# EAGLE design Dub_Siren (EAGLE 5.10)
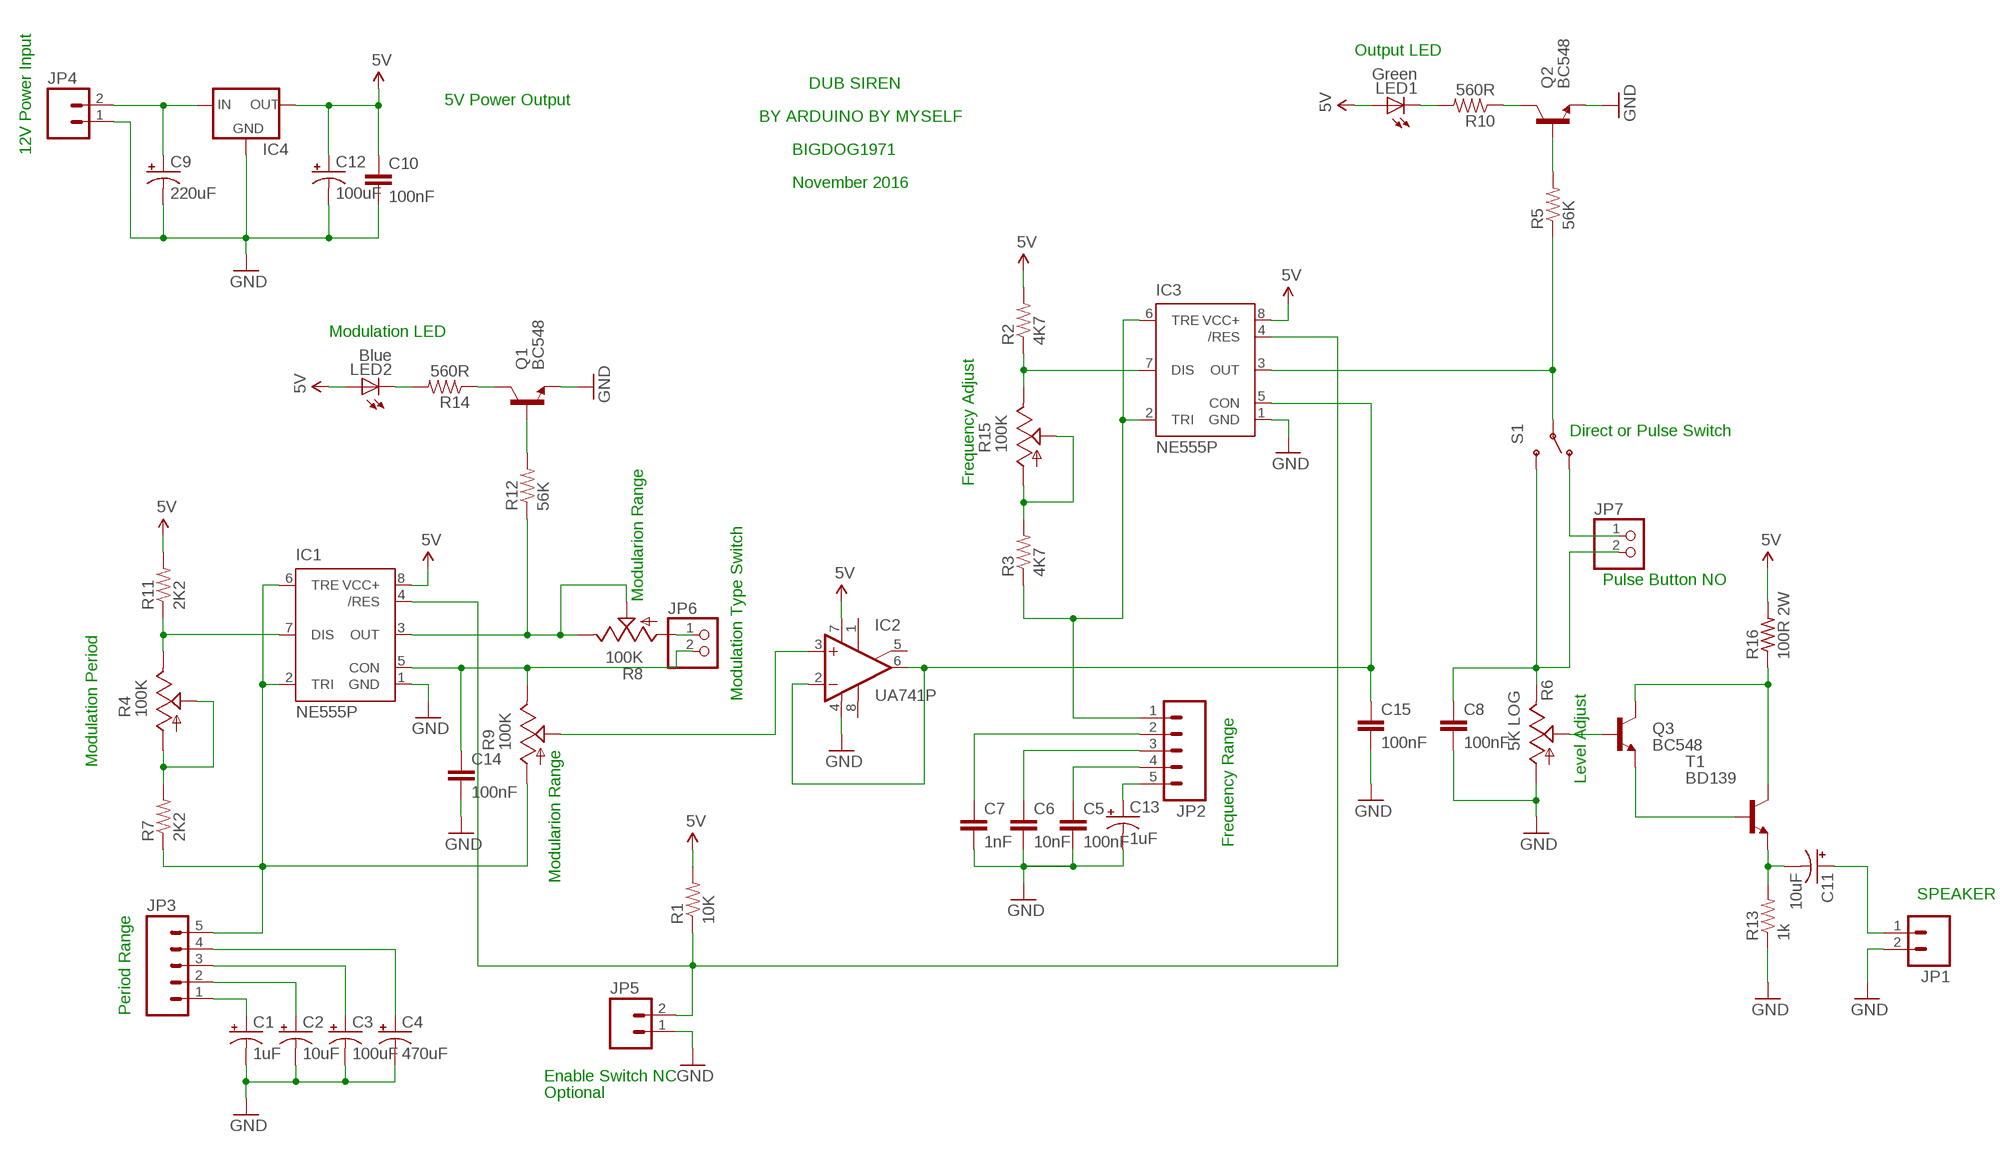
[diagram p0: schematic, sheet 1]

## Parts
C1  1uF  CAP_POLPTH1  [CPOL-RADIAL-100UF-25V]
C2  10uF  CAP_POLPTH1  [CPOL-RADIAL-100UF-25V]
C3  100uF  CAP_POLPTH1  [CPOL-RADIAL-100UF-25V]
C4  470uF  CAP_POLPTH1  [CPOL-RADIAL-100UF-25V]
C5  100nF  CAPPTH1  [CAP-PTH-5MM]
C6  10nF  CAPPTH1  [CAP-PTH-5MM]
C7  1nF  CAPPTH1  [CAP-PTH-5MM]
C8  100nF  CAPPTH1  [CAP-PTH-5MM]
C9  220uF  CAP_POLPTH1  [CPOL-RADIAL-100UF-25V]
C10  100nF  CAPPTH1  [CAP-PTH-5MM]
C11  10uF  CAP_POLPTH1  [CPOL-RADIAL-100UF-25V]
C12  100uF  CAP_POLPTH1  [CPOL-RADIAL-100UF-25V]
C13  1uF  CAP_POLPTH1  [CPOL-RADIAL-100UF-25V]
C14  100nF  CAPPTH1  [CAP-PTH-5MM]
C15  100nF  CAPPTH1  [CAP-PTH-5MM]
IC1  NE555P  [DIL-08]
IC2  UA741P  [DIL08]
IC3  NE555P  [DIL-08]
IC4  V_REG_78XXSINK  [TO220-IGO]
JP1  M02PTH3  [1X02_LONGPADS]
JP2  M05PTH_LONGPADS  [1X05_LONGPADS]
JP3  M05PTH_LONGPADS  [1X05_LONGPADS]
JP4  M02LOCK_LONGPADS  [1X02_LOCK_LONGPADS]
JP5  M02LOCK_LONGPADS  [1X02_LOCK_LONGPADS]
JP6  PINHD-1X2  [1X02]
JP7  PINHD-1X2  [1X02]
LED1  Green  LED5MM  [LED5MM]
LED2  Blue  LED5MM  [LED5MM]
Q1  BC548  TRANSISTOR_NPNTO-92-AMMO  [TO-92-AMMO]
Q2  BC548  TRANSISTOR_NPNTO-92-AMMO  [TO-92-AMMO]
Q3  BC548  TRANSISTOR_NPNTO-92-AMMO  [TO-92-AMMO]
R1  10K  RESISTORPTH-1/4W  [AXIAL-0.4]
R2  4K7  RESISTORPTH-1/4W  [AXIAL-0.4]
R3  4K7  RESISTORPTH-1/4W  [AXIAL-0.4]
R4  100K  TRIM_US-RS3  [RS3]
R5  56K  RESISTORPTH-1/4W  [AXIAL-0.4]
R6  5K LOG  TRIM_US-RS3  [RS3]
R7  2K2  RESISTORPTH-1/4W  [AXIAL-0.4]
R8  100K  TRIM_US-RS3  [RS3]
R9  100K  TRIM_US-RS3  [RS3]
R10  560R  RESISTORPTH-1/4W  [AXIAL-0.4]
R11  2K2  RESISTORPTH-1/4W  [AXIAL-0.4]
R12  56K  RESISTORPTH-1/4W  [AXIAL-0.4]
R13  1k  RESISTORPTH-1/4W  [AXIAL-0.4]
R14  560R  RESISTORPTH-1/4W  [AXIAL-0.4]
R15  100K  TRIM_US-RS3  [RS3]
R16  100R 2W  R-US_0309/12  [0309/12]
S1  SWITCH-SPSTKIT  [SWITCH-SPDT_KIT]
T1  BD139  [TO126]

## Nets
5V: C10.1 C12.1(+) IC1.8(VCC+) IC2.7(V+) IC3.8(VCC+) IC4.OUT LED1.A LED2.A R1.P$2 R2.P$2 R11.P$2 R16.2
GND: C1.2(-) C2.2(-) C3.2(-) C4.2(-) C5.2 C6.2 C7.2 C8.2 C9.2(-) C10.2 C12.2(-) C13.2(-) C14.2 C15.2 IC1.1(GND) IC2.4(V-) IC3.1(GND) IC4.GND JP1.2 JP4.1 JP5.1 Q1.1(E) Q2.1(E) R6.A R13.P$1
N$1: IC1.2(TRI) IC1.6(TRE) JP3.5 R7.P$1 R9.A
N$2: Q3.2(B) R6.S
N$3: R4.A R4.S R7.P$2
N$4: IC1.7(DIS) R4.E R11.P$1
N$5: C14.1 IC1.5(CON) JP6.2 R9.E
N$6: IC1.4(/RES) IC3.4(/RES) JP5.2 R1.P$1
N$7: IC1.3(OUT) R8.E R8.S R12.P$1
N$8: Q3.1(E) T1.3(B)
N$9: JP6.1 R8.A
N$10: C15.1 IC2.2(-IN) IC2.6(OUT) IC3.5(CON)
N$11: LED2.K(C) R14.P$2
N$12: Q1.3(C) R14.P$1
N$13: C13.1(+) JP2.5
N$14: IC3.7(DIS) R2.P$1 R15.E
N$15: R3.P$2 R15.A R15.S
N$16: C11.2(-) R13.P$2 T1.1(E)
N$17: IC3.2(TRI) IC3.6(TRE) JP2.1 R3.P$1
N$18: Q3.3(C) R16.1 T1.2(C)
N$19: LED1.K(C) R10.P$2
N$20: Q2.3(C) R10.P$1
N$21: Q2.2(B) R5.P$2
N$22: IC2.3(+IN) R9.S
N$23: IC3.3(OUT) R5.P$1 S1.2(P)
N$25: C4.1(+) JP3.4
N$26: C11.1(+) JP1.1
N$27: C3.1(+) JP3.3
N$28: C2.1(+) JP3.2
N$29: C1.1(+) JP3.1
N$30: C5.1 JP2.4
N$31: C6.1 JP2.3
N$32: C7.1 JP2.2
N$33: Q1.2(B) R12.P$2
N$34: C9.1(+) IC4.IN JP4.2
N$35: JP7.1 S1.1(O)
N$36: C8.1 JP7.2 R6.E S1.3(S)
Unconnected: IC2.1(ON1) IC2.5(ON2) IC2.8(OPT)

## Notes on the sheet
- Output LED
- DUB SIREN
- 5V Power Output
- BY ARDUINO BY MYSELF
- 12V Power Input | BIGDOG1971
- November 2016
- Modulation LED
- Direct or Pulse Switch
- Frequency Adjust
- Pulse Button NO
- Modularion Range
- Modulation Type Switch
- Frequency Range
- Modulation Period
- Level Adjust
- Modularion Range
- SPEAKER
- Period Range
- Enable Switch NC
- Optional

## Library data of the parts
C1-C4 C9 C11-C13 = SparkFun:CAP_POL: Capacitor Polarized These are standard SMD and PTH capacitors. Normally 10uF, 47uF, and 100uF in electrolytic and tantalum varieties. Always verify the external diameter of the through hole cap, it varies with capacity, voltage, and manufacturer. The EIA devices should be standard.
C5-C8 C10 C14 C15 = SparkFun:CAP: Capacitor Standard 0603 ceramic capacitor, and 0.1" leaded capacitor.
IC1 IC3 = SparkFun:NE555: General purpose bipolar Timer; MF: Arrow Electronics; MPN: NE555N; OC_FARNELL: 1467742; OC_NEWARK: 89K1486
IC2 = linear:*741: OP AMP
IC4 = SparkFun:V_REG_78XX: Voltage Regulator Standard 7805 5V regulator. IGO (Input Ground Output). Spark Fun Electronics SKU : COM-00107
JP1 JP4 JP5 = SparkFun:M02: Header 2 Standard 2-pin 0.1" header. Use with straight break away headers (SKU : PRT-00116), right angle break away headers (PRT-00553), swiss pins (PRT-00743), machine pins (PRT-00117), and female headers (PRT-00115). Molex polarized connector foot print use with SKU : PRT-08233 with associated crimp pins and housings.
JP2 JP3 = SparkFun:M05: Header 5 Standard 5-pin 0.1" header. Use with straight break away headers (SKU : PRT-00116), right angle break away headers (PRT-00553), swiss pins (PRT-00743), machine pins (PRT-00117), and female headers (PRT-00115). Molex polarized connector foot print use with SKU : PRT-08230 with associated crimp pins and housings.
JP6 JP7 = pinhead:PINHD-1X2: PIN HEADER
LED1 LED2 = SparkFun:LED: LEDs Standard schematic elements and footprints for 5mm, 3mm, 1206, and 0603 sized LEDs. 5mm - Spark Fun Electronics SKU : COM-00529 (and others)
Q1-Q3 = SparkFun:TRANSISTOR_NPN: Transistor NPN BJT configuration in SOT23 package. MMBT2222 is the common NPN we use. Double check BCE configuration again layout.
R1-R3 R5 R7 R10-R14 = SparkFun:RESISTOR: Resistor Basic schematic elements and footprints for 0603, 1206, and PTH resistors.
R4 R6 R8 R9 R15 = pot:TRIM_US-: POTENTIOMETER
R16 = resistor:R-US_: RESISTOR, American symbol
S1 = SparkFun:SWITCH-SPST: SPST Switch Simple slide switch. Spark Fun Electronics SKU : COM-00102
T1 = transistor:BD139: NPN TRANSISTOR

## Net classes
0 default: width 0.508 mm, drill 0.508 mm, clearance 0.508 mm

## Board
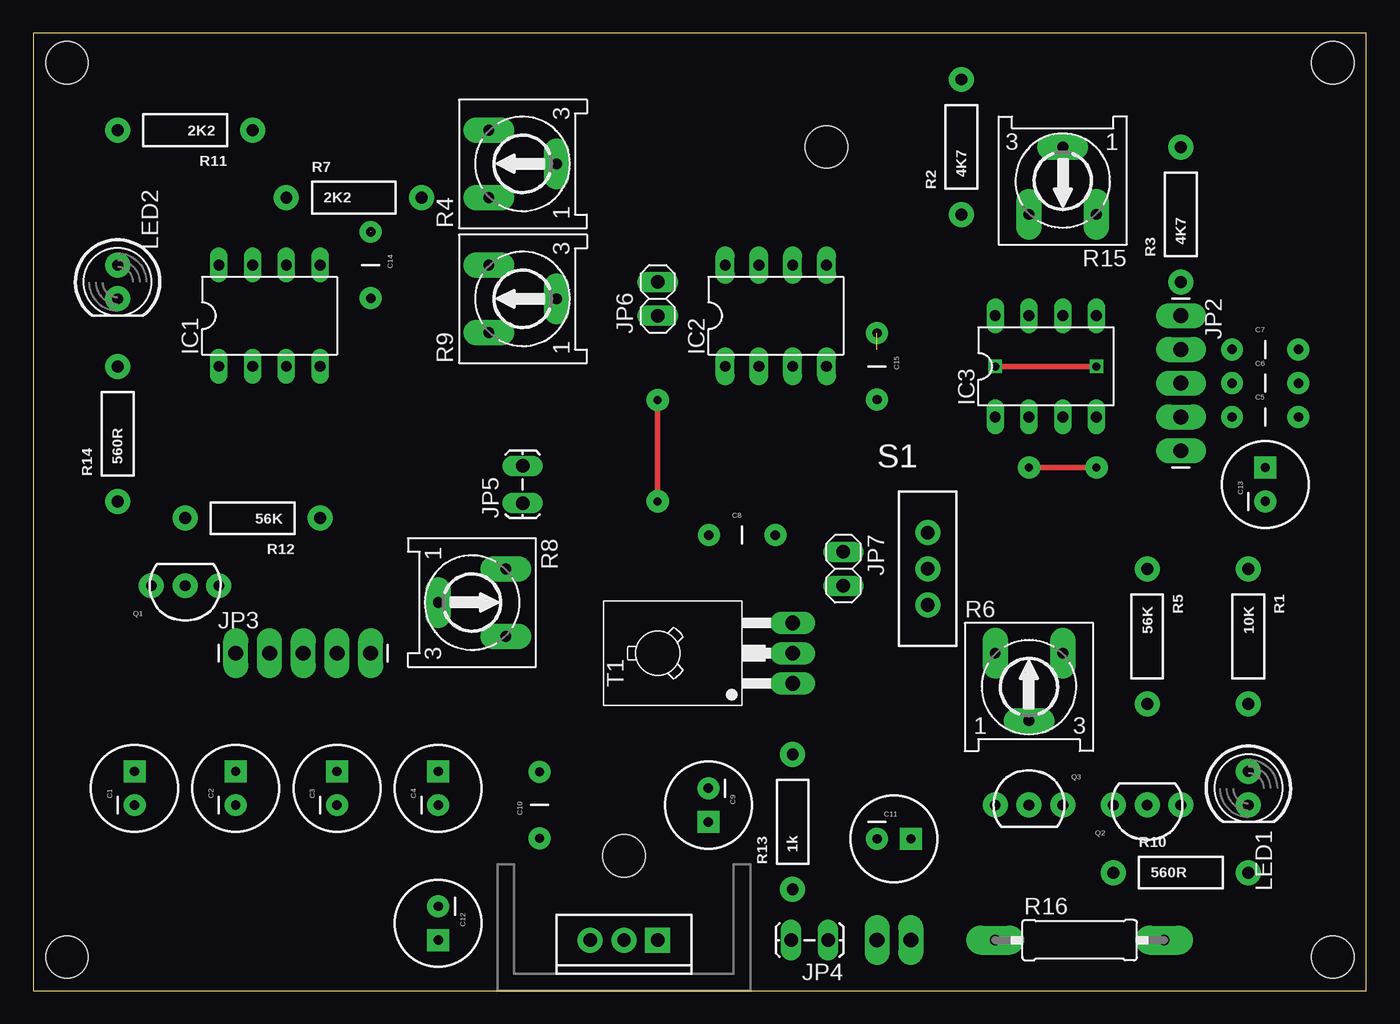
[diagram p1: board, top side]
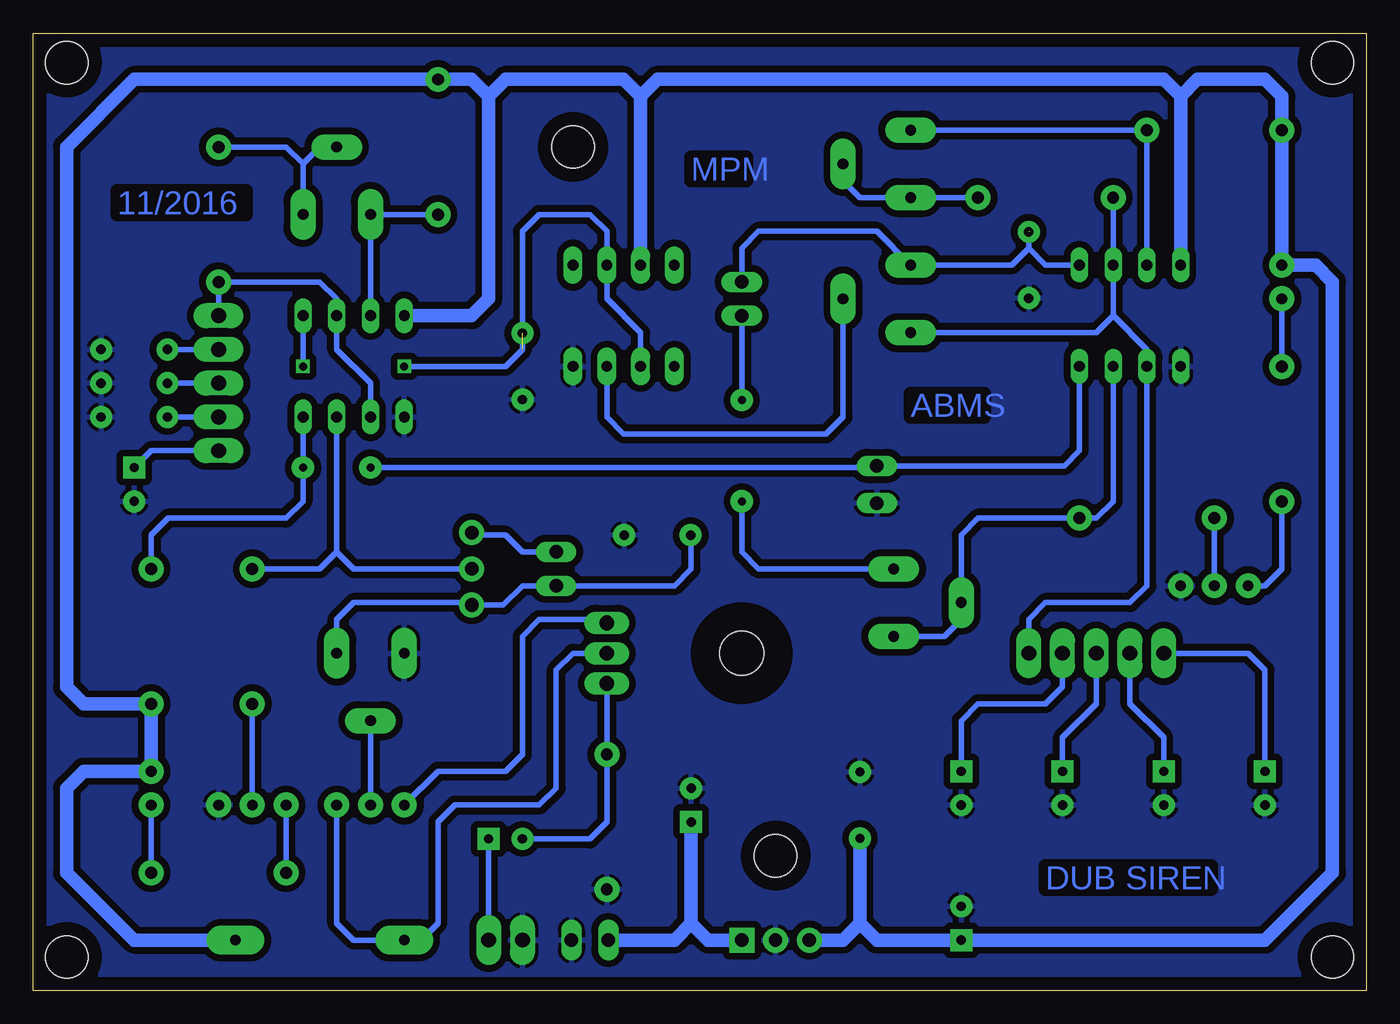
[diagram p2: board, bottom side, seen from below]

Size 100.31 x 72.06 mm. Coordinates in mm from the lower left corner, seen from the top.
Outline: 0,0 100.31,0 100.31,72.06 0,72.06 0,0
Copper layers (1*16): Top 0.035mm / dielectric 1.5mm / Bottom 0.035mm
Design rules "default": minimum track width 10mil, minimum drill 24mil, track to track 8mil, track to pad 8mil, pad to pad 8mil, via to via 8mil, smd to smd 8mil, copper to edge 40mil, drill to drill 8mil, minimum pad ring 10mil, minimum via ring 8mil, stop-mask expansion 4mil, vias tented up to drill 0mil, thermal gap 10mil
Holes 3.2 mm at 2.54,69.85 97.79,69.85 97.79,2.54 2.54,2.54 59.69,63.5 44.45,10.16

### Footprints (pad centres in the part's own frame; a part is rotated, then mirrored left to right if it is on the bottom)
CPOL-RADIAL-100UF-25V = drill 0.7 pad 1.651 square: 1 1.27,0 | drill 0.7 pad 1.651 round: 2 -1.27,0
CAP-PTH-5MM = drill 0.7 pad 1.651 round: 1 -2.5,0; 2 2.5,0
DIL-08 = drill 0.813 long: 1 -3.81,-3.81; 2 -1.27,-3.81; 3 1.27,-3.81; 4 3.81,-3.81; 5 3.81,3.81; 6 1.27,3.81; 7 -1.27,3.81; 8 -3.81,3.81
DIL08 = drill 0.813 pad 1.422 long: 1 -3.81,-3.81; 2 -1.27,-3.81; 3 1.27,-3.81; 4 3.81,-3.81; 5 3.81,3.81; 6 1.27,3.81; 7 -1.27,3.81; 8 -3.81,3.81
TO220-IGO = drill 1 pad 1.88 round: GND 0,0; OUT 2.54,0 | drill 1 pad 1.88 square: IN -2.54,0
1X02_LONGPADS = drill 1.118 pad 1.88 long: 1 0,0; 2 2.54,0
1X05_LONGPADS = drill 1.118 pad 1.88 long: 1 0,0; 2 2.54,0; 3 5.08,0; 4 7.62,0; 5 10.16,0
1X02_LOCK_LONGPADS = drill 1.016 long: 1 -0.127,0; 2 2.667,0
1X02 = drill 1.016 long: 1 -1.27,0; 2 1.27,0
LED5MM = drill 0.813 pad 1.88 round: A -1.27,0; K 1.27,0
TO-92-AMMO = drill 0.813 pad 1.88 round: 1 -2.54,0; 2 0,0; 3 2.54,0
AXIAL-0.4 = drill 0.9 pad 1.88 round: P$1 -5.08,0; P$2 5.08,0
RS3 = drill 0.813 pad 1.93 long: A -2.54,2.54; E 2.54,2.54; S 0,-2.54
0309/12 = drill 0.813 pad 2.184 long: 1 -6.35,0; 2 6.35,0
SWITCH-SPDT_KIT = drill 1.016 pad 1.88 round: 1 0,2.718; 2 0,0; 3 0,-2.718
TO126 = drill 1.118 long: 1 -2.286,-5.08; 2 0,-5.08; 3 2.286,-5.08 | hole 3.302: 0,5.08

### Placement (x,y rotation side)
C1  7.62,15.24 90 top
C2  15.24,15.24 90 top
C3  22.86,15.24 90 top
C4  30.48,15.24 90 top
C5  92.71,43.18 0 top
C6  92.71,45.72 0 top
C7  92.71,48.26 0 top
C8  53.34,34.29 0 top
C9  50.8,13.97 270 top
C10  38.1,13.97 90 top
C11  64.77,11.43 0 top
C12  30.48,5.08 270 top
C13  92.71,38.1 90 top
C14  25.4,54.61 270 top
C15  63.5,46.99 270 top
IC1  17.78,50.8 0 top
IC2  55.88,50.8 0 top
IC3  76.2,46.99 0 top
IC4  44.45,3.81 180 top
JP1  66.04,3.81 180 top
JP2  86.36,50.8 270 top
JP3  15.24,25.4 0 top
JP4  59.69,3.81 180 top
JP5  36.83,36.83 90 top
JP6  46.99,52.07 90 top
JP7  60.96,31.75 270 top
LED1  91.44,15.24 270 top
LED2  6.35,53.34 270 top
Q1  11.43,30.48 180 top
Q2  83.82,13.97 180 top
Q3  74.93,13.97 0 top
R1  91.44,26.67 270 top
R2  69.85,63.5 90 top
R3  86.36,58.42 90 top
R4  36.83,62.23 90 top
R5  83.82,26.67 270 top
R6  74.93,22.86 0 top
R7  24.13,59.69 0 top
R8  33.02,29.21 270 top
R9  36.83,52.07 90 top
R10  86.36,8.89 0 top
R11  11.43,64.77 180 top
R12  16.51,35.56 180 top
R13  57.15,12.7 90 top
R14  6.35,41.91 90 top
R15  77.47,60.96 180 top
R16  78.74,3.81 0 top
S1  67.31,31.75 0 top
T1  52.07,25.4 90 top

### Tracks (layer width: path | path; a pad name or v marks a point on that pad's centre or on a via)
5V
  Bottom 0.406: 38.1,11.43 C10.1
  Bottom 1.016: IC3.8 67.31,50.8 66.04,52.07 66.04,67.31 | 66.04,67.31 67.31,68.58 R2.P$2 92.71,68.58 97.79,63.5 97.79,22.86 96.52,21.59 R1.P$2 LED1.A 96.52,16.51 97.79,15.24 97.79,8.89 92.71,3.81 R16.2 | 54.61,67.31 55.88,68.58 64.77,68.58 66.04,67.31 | 54.61,67.31 IC2.7 | 54.61,67.31 53.34,68.58 15.24,68.58 13.97,67.31 | 13.97,67.31 IC1.8 | 13.97,67.31 12.7,68.58 7.62,68.58 6.35,67.31 R11.P$2 LED2.A 3.81,54.61 2.54,53.34 2.54,8.89 7.62,3.81 C12.1 36.83,3.81 38.1,5.08 | IC4.OUT 39.37,3.81 38.1,5.08 | 38.1,5.08 38.1,11.43
GND
  pour Bottom: -1.27,73.66 101.6,73.66 101.6,-1.27 -1.27,-1.27
N$1
  Bottom 0.406: R7.P$1 IC1.6 19.05,50.8 | JP3.5 25.4,27.94 24.13,29.21 17.78,29.21 16.51,30.48 IC1.2 16.51,48.26 19.05,50.8 | R9.A 20.32,49.53 19.05,50.8
N$2
  Bottom 0.406: Q3.2 R6.S
N$3
  Bottom 0.406: R7.P$2 R4.A 38.1,59.69 39.37,60.96 R4.S
N$4
  Bottom 0.406: IC1.7 R11.P$1 R4.E
N$5  (1 unrouted)
  Bottom 0.406: IC1.5 24.13,54.61 25.4,55.88 | 25.4,55.88 25.4,57.15 | 25.4,55.88 26.67,54.61 R9.E 36.83,57.15 45.72,57.15 46.99,55.88 JP6.2
N$6  (via drill 0.6 pad 1.68)
  Top 0.406: v74.93,39.37 v80.01,39.37
  Bottom 0.406: v74.93,39.37 36.83,39.37 JP5.2 22.73,39.5 21.59,40.64 IC1.4 | IC3.4 v80.01,39.37 80.01,36.83 81.28,35.56 90.17,35.56 91.44,34.29 R1.P$1
N$7
  Bottom 0.406: IC1.3 19.05,36.83 20.32,35.56 R12.P$1 29.21,35.56 30.48,34.29 R8.S 30.48,27.94 31.75,26.67 R8.E
N$8
  Bottom 0.406: Q3.1 69.85,16.51 64.77,16.51 63.5,17.78 63.5,26.67 62.23,27.94 57.4,27.94 T1.3
N$9  (via drill 0.6 pad 1.68)
  Top 0.406: v46.99,36.83 v46.99,44.45
  Bottom 0.406: v46.99,44.45 JP6.1 | v46.99,36.83 46.99,33.02 45.72,31.75 R8.A
N$10  (via drill 0.6)  (1 unrouted)
  Top 0.406: v72.39,46.99 v80.01,46.99
  Bottom 0.406: IC2.2 54.61,49.53 57.15,52.07 IC2.6 57.15,57.15 58.42,58.42 62.23,58.42 63.5,57.15 63.5,48.26 64.77,46.99 v72.39,46.99 | v80.01,46.99 IC3.5
N$11
  Bottom 0.406: R14.P$2 LED2.K
N$12
  Bottom 0.406: Q1.3 7.62,30.48 6.35,31.75 R14.P$1
N$13
  Bottom 0.406: JP2.5 91.44,40.64 C13.1
N$14
  Bottom 0.406: IC3.7 R15.E R2.P$1
N$15
  Bottom 0.406: R15.S 78.74,63.5 80.01,62.23 | R15.A 80.01,62.23 | 80.01,62.23 81.28,63.5 R3.P$2
N$16
  Bottom 0.406: C11.2 58.42,11.43 57.15,12.7 R13.P$2 T1.1
N$17
  Bottom 0.406: IC3.2 74.93,45.72 77.47,48.26 IC3.6 77.47,52.07 78.74,53.34 R3.P$1 JP2.1
N$18
  Bottom 0.406: Q3.3 77.47,5.08 76.2,3.81 R16.1 71.12,3.81 69.85,5.08 69.85,12.7 68.58,13.97 62.23,13.97 60.96,15.24 60.96,24.13 59.69,25.4 T1.2
N$19
  Bottom 0.406: R10.P$2 LED1.K
N$20
  Bottom 0.406: R10.P$1 Q2.3
N$21
  Bottom 0.406: Q2.2 R5.P$2
N$22
  Bottom 0.406: R9.S 39.37,43.18 40.64,41.91 55.88,41.91 57.15,43.18 IC2.3
N$23
  Bottom 0.406: 77.47,33.02 IC3.3 | 77.47,33.02 78.74,31.75 R5.P$1 | S1.2 76.2,31.75 77.47,33.02
N$24
  pour Bottom: 57.15,27.94 57.15,25.4 59.69,25.4 60.96,24.13 60.96,15.24 62.23,13.97 68.58,13.97 69.85,12.7 69.85,5.08 71.12,3.81 76.2,3.81 77.47,5.08 77.47,13.97 72.39,13.97 69.85,16.51 64.77,16.51 63.5,17.78 63.5,26.67 62.23,27.94
N$25
  Bottom 0.406: JP3.4 22.86,22.86 24.13,21.59 29.21,21.59 30.48,20.32 C4.1
N$26
  Bottom 0.406: JP1.1 C11.1
N$27
  Bottom 0.406: C3.1 22.86,19.05 20.32,21.59 JP3.3
N$28
  Bottom 0.406: C2.1 15.24,19.05 17.78,21.59 JP3.2
N$29
  Bottom 0.406: C1.1 7.62,24.13 8.89,25.4 JP3.1
N$30
  Bottom 0.406: JP2.4 C5.1
N$31
  Bottom 0.406: JP2.3 C6.1
N$32
  Bottom 0.406: JP2.2 C7.1
N$33
  Bottom 0.406: Q1.2 R12.P$2
N$34
  Bottom 0.508: JP4.2 57.15,3.81
  Bottom 1.016: 50.8,5.08 C9.1 | 50.8,5.08 49.53,3.81 IC4.IN | JP4.2 52.07,3.81 50.8,5.08
N$35
  Bottom 0.406: JP7.1 63.5,33.02 64.77,34.29 67.13,34.29 S1.1
N$36
  Bottom 0.406: R6.E 77.47,27.94 76.2,29.21 67.49,29.21 S1.3 64.95,29.03 63.5,30.48 JP7.2 52.07,30.48 50.8,31.75 50.8,34.25 C8.1

### Text on the board
Bottom: MPM | 11/2016 | ABMS | DUB SIREN